# Altium schematic sheet S7CAS-PLEIADES-CARTE-MERE_Pxx_MECANICAL.SchDoc
size Tabloid; SheetNumber: 17; SheetTotal: 18; Sheet_Name: MECANICAL; Size: 11x17
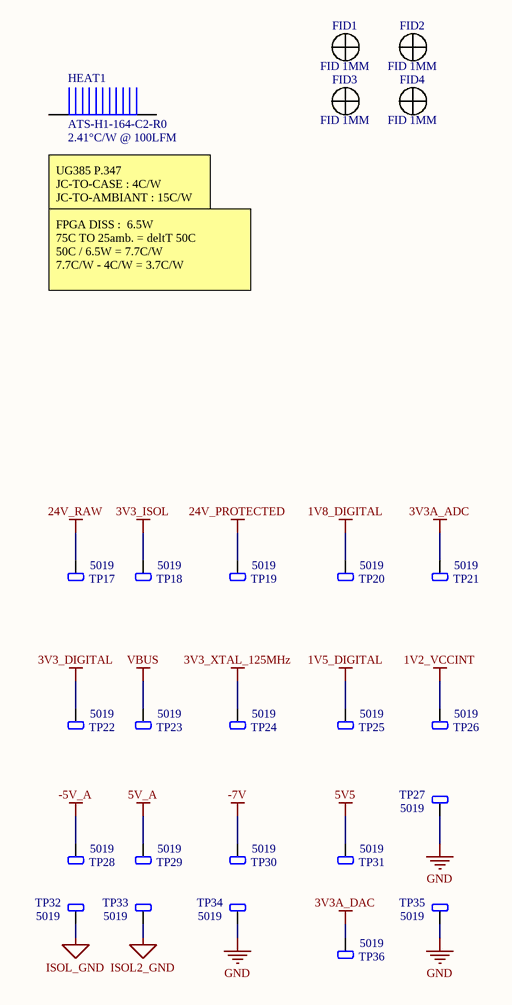
[diagram p0: S7CAS-PLEIADES-CARTE-MERE_Pxx_MECANICAL.SchDoc]

## Parts
FID1  FID 1MM  [FID_CIRCLE_1MM - PASTE_MASK]
FID2  FID 1MM  [FID_CIRCLE_1MM - PASTE_MASK]
FID3  FID 1MM  [FID_CIRCLE_1MM - PASTE_MASK]
FID4  FID 1MM  [FID_CIRCLE_1MM - PASTE_MASK]
HEAT1  ATS-H1-164-C2-R0  Thermal Resistance: 2.41°C/W @ 100LFM  [ATS-H1-164-C2-R0]
TP17  5019  [TPO_SMD_5019]
TP18  5019  [TPO_SMD_5019]
TP19  5019  [TPO_SMD_5019]
TP20  5019  [TPO_SMD_5019]
TP21  5019  [TPO_SMD_5019]
TP22  5019  [TPO_SMD_5019]
TP23  5019  [TPO_SMD_5019]
TP24  5019  [TPO_SMD_5019]
TP25  5019  [TPO_SMD_5019]
TP26  5019  [TPO_SMD_5019]
TP27  5019  [TPO_SMD_5019]
TP28  5019  [TPO_SMD_5019]
TP29  5019  [TPO_SMD_5019]
TP30  5019  [TPO_SMD_5019]
TP31  5019  [TPO_SMD_5019]
TP32  5019  [TPO_SMD_5019]
TP33  5019  [TPO_SMD_5019]
TP34  5019  [TPO_SMD_5019]
TP35  5019  [TPO_SMD_5019]
TP36  5019  [TPO_SMD_5019]

## Nets
1V2_VCCINT: TP26.1
1V5_DIGITAL: TP25.1
1V8_DIGITAL: TP20.1
3V3_DIGITAL: TP22.1
3V3_ISOL: TP18.1
3V3_XTAL_125MHz: TP24.1
3V3A_ADC: TP21.1
3V3A_DAC: TP36.1
5V5: TP31.1
5V_A: TP29.1
24V_PROTECTED: TP19.1
24V_RAW: TP17.1
-5V_A: TP28.1
-7V: TP30.1
GND: TP27.1 TP34.1 TP35.1
ISOL2_GND: TP33.1
ISOL_GND: TP32.1
VBUS: TP23.1

Not connected (* = marked no-connect by the designer): FID1 1 2; FID2 1 2; FID3 1 2; FID4 1 2; HEAT1 1 2

## Notes on the sheet
- (near HEAT1) UG385 P.347
  JC-TO-CASE : 4C/W
  JC-TO-AMBIANT : 15C/W
- FPGA DISS :  6.5W
  75C TO 25amb. = deltT 50C
  50C / 6.5W = 7.7C/W
  7.7C/W - 4C/W = 3.7C/W
- Sheet Name
- Project Title
- Global Project
- Size
- Group
- Revision
- Date
- Sheet
- of
- Filename
- Designers

## Library data of the parts
FID1-FID4 = FID_CIRCLE_1MM_PASTE_MASK: FID - FIDUCIAL 1MM CIRCLE DOUBLE-SIDED - 1MM; GRAMS Lib Spec: 2.8; Magnetic Material: NO; Cryo: UNKNOWN; Value: *; Tolerance: *; Voltage Rating: *; Current Rating: *; Power Max: *; HelpURL: https://www.pcb-3d.com/wordpress/wp-content/uploads/ipc-sm-782a_amendment_1_and_2.pdf; CreatedBy/Date: Jonathan Bouchard 2018-07-23; VerifiedBy: Caroline Paulin - 25 juillet 2018; Temperature: *; Package: 1MM CIRCLE; Manufacturer #1: *; Manufacturer #2: *; Note: *; Assembly Type: NONE; Part Number #2: *; Part Number #1: *; Polarized: *; Supplier 1: *; Supplier Part Number 1: *
HEAT1 = HEATSINK_ATS-H1-164-C2-R0: Heatsink Aluminium; Mfr: Advanced Thermal Solutions Inc.; Hole Size: 3mm; Hole-to-hole: 70.71mm; Fin Height: 35mm; Length: 45mm; Width: 45mm; Material: Aluminium; ComponentLink1Description: Digikey; ComponentLink1URL: https://www.digikey.com/en/products/detail/advanced-thermal-solutions-inc/ATS-H1-164-C2-R0/4624459; Supplier 1: Digikey; Supplier Part Number 1: ATS36354-ND; ComponentLink2Description: Mfr; ComponentLink2URL: https://www.qats.com/Online-PushPin/ATS-H1-164-C2-R0
TP17-TP36 = TPO_SMD_5019: TPO - PC TEST POINT MINI - SMD; Manufacturer #1: Keystone Electronics; Value: 3.81mm x 2.03mm; Polarized: No; Magnetic Material: UNKNOWN; GRAMS Lib Spec: 2.8; Current Rating: *; Manufacturer #2: *; Note: *; Power Max: *; Part Number #2: *; HelpURL: https://www.digikey.ca/product-detail/en/keystone-electronics/5019/36-5019CT-ND/3907344; Supplier 1: Digi-Key; Supplier Part Number 1: 36-5019CT-ND; Assembly Type: SMD; Part Number #1: 5019; Package: SMD; CreatedBy/Date: Olivier Bernard / 5/12/2017; Temperature: *; Tolerance: *; VerifiedBy: Caroline Paulin / 5 juillet 2018; Voltage Rating: *; Cryo: UNKNOWN